# EasyEDA Pro project avaruusantenni_tallylight.eprj, board PCB1
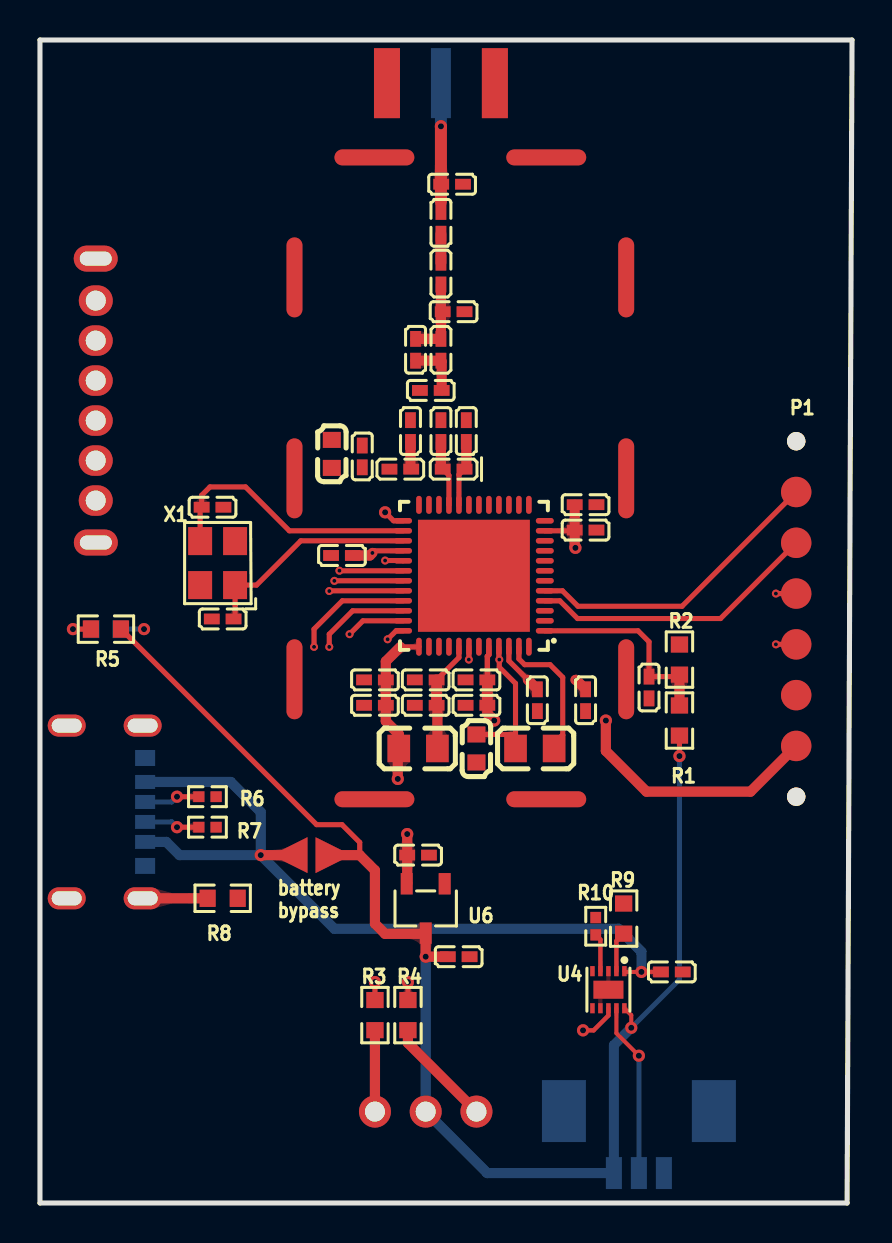
[diagram p8: board, top side]
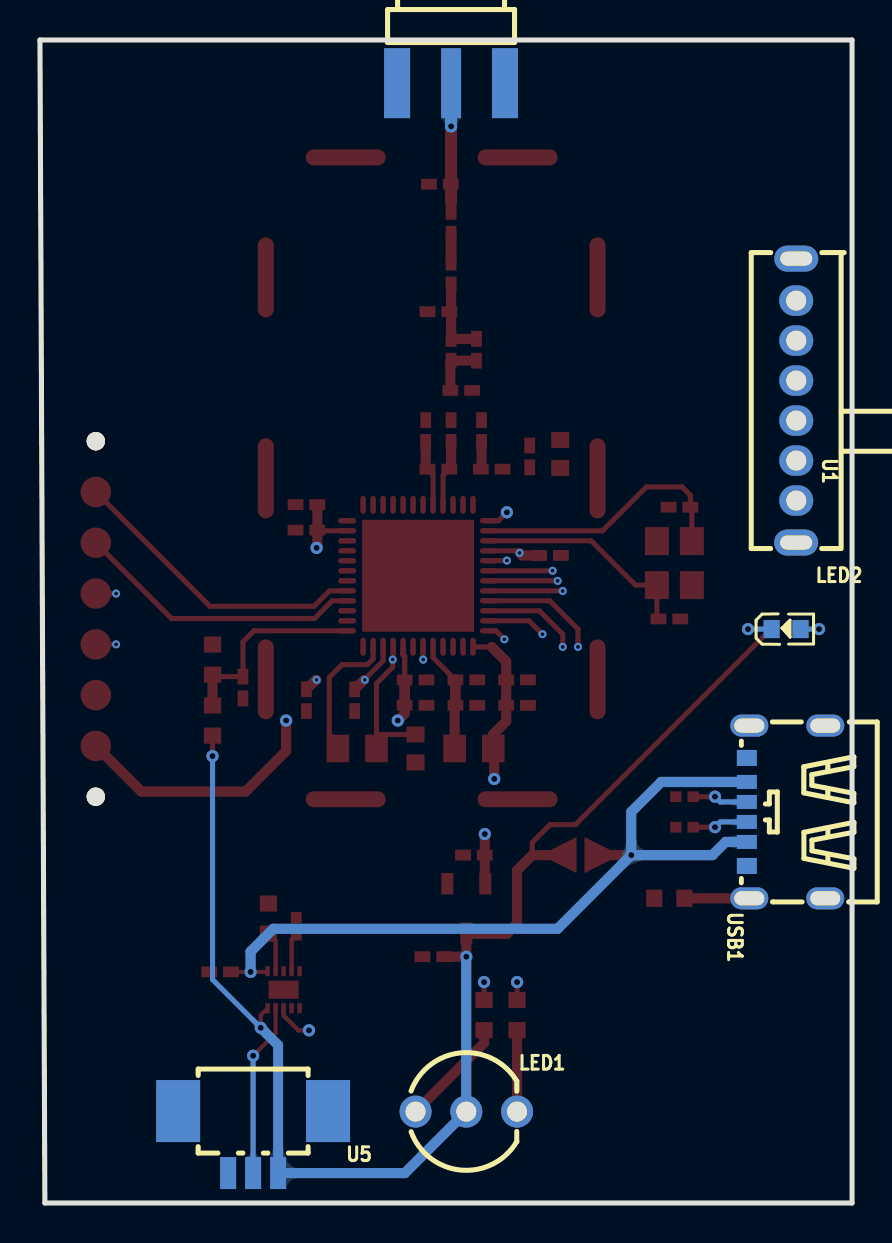
[diagram p9: board, bottom side, seen from below]

Outline 40.64 x 58.17 mm; copper layers: Top Layer, Inner1, Inner2, Bottom Layer. Coordinates in mm from the lower left corner of the outline.
Outline path: 0,58.17 40.64,58.17 40.39,0 0,0 0,58.17
Stack: Top Layer 0.035mm / Dielectric1 0.48mm PP er 4.5 / Inner1 0.035mm / Dielectric2 0.48mm FR4 er 4.5 / Inner2 0.035mm / Dielectric3 0.48mm PP er 4.5 / Bottom Layer 0.035mm

## Design rules (mm)
template: Custom Config
spacing copperThickness1oz (default): track to track 0.102, other pairs 0.152 to 0.3
spacing copperThickness2oz: track to track 0.203, other pairs 0.152 to 0.3
spacing copperThicknessInner0.5oz: track to track 0.089, other pairs 0.152 to 0.3
spacing Tight clearance: track to track 0.1, other pairs 0.1 to 0.3
track width copperThickness1oz (default): min 0.102, default 0.254, max 2.54
track width copperThickness2oz: min 0.203, default 0.254, max 2.54
track width copperThickness0.5oz: min 0.089, default 0.254, max 2.54
differential pair differentialPair (default): width min 0.127, default 0.254, max 2.54; gap min 0.152, default 0.152
via viaSize (default): diameter min 0.3, default 0.61, max 10; hole min 0.2, default 0.305, max 6.3
via viaSmall: diameter min 0.4, default 0.4, max 0.8; hole min 0.2, default 0.2, max 0.4
net RFI_P uses Trace pour
net RFI_N uses Trace pour
net RFO_HP uses Trace pour
net VR_PA uses Trace pour
net FB uses viaSmall
net SWDIO uses viaSmall
net PWR_LED uses viaSmall
net SWCLK uses viaSmall
net TALLYLED uses viaSmall
net AUXLED uses viaSmall
net SW_1 uses viaSmall
net SW_2 uses viaSmall
net SW_PWR uses viaSmall
net $3I6007/$1N692 uses Trace pour
net $3I6007/$1N693 uses Trace pour
net VDDPA uses viaSmall
['net', 'gnd'] ['NET', '$2N1736'] uses Trace pour

## Placement (name value [footprint] x y rotation side)
C1  10pF  [C0402]  9.14 29.21 0 top
C2  10pF  [C0402]  8.64 34.8 0 top
C3  47nF  [C0603]  14.6 37.47 270 top
C4  47pF  [C0402]  16.13 37.34 270 top
C5  2.2pF  [C0402]  18.8 42.67 90 top
C6  33pF  [C0402]  18.54 38.61 90 top
C7  33pF  [C0402]  20.07 49.02 90 top
C8  0.7pF  [C0402]  19.56 40.64 0 top
C9  7.5pF  [C0402]  20.7 44.58 180 top
C10  4.7pF  [C0402]  20.07 38.61 270 top
C11  2.2pF  [C0402]  20.62 50.95 180 top
C12  4.7pF  [C0402]  21.34 38.61 270 top
C14  470nF  [C0603]  21.84 22.73 90 top
C15  4.7uF  [C0402]  19.3 24.89 0 top
C16  100nF  [C0402]  19.3 26.16 0 top
C17  33pF  [C0402]  21.84 24.89 0 top
C18  100nF  [C0402]  21.84 26.16 0 top
C19  33pF  [C0402]  27.31 33.66 180 top
C20  100nF  [C0402]  27.31 34.92 180 top
C21  33pF  [C0402]  16.76 26.16 0 top
C22  100nF  [C0402]  16.76 24.89 0 top
C23  100nF  [C0402]  15.11 32.38 0 top
C24  4.7uF  [C0402]  27.31 25.15 90 top
C25  1uF  [C0402]  31.62 11.56 180 top
C26  1uF  [C0402]  20.96 12.32 180 top
C27  100nF  [C0402]  24.89 25.15 90 top
C28  1uF  [C0402]  18.92 17.4 180 top
C29  100nF  [C0402]  30.48 25.78 90 top
L1  47nH  [L0402]  18.03 36.7 180 top
L2  3.3nH  [L0402]  20.07 42.67 90 top
L3  8.2nH  [L0402]  20.07 46.48 90 top
L4  9.1nH  [L0402-RD]  20.7 36.7 180 top
L5  15uH  [L0805]  24.76 22.73 180 top
L6  Ferrite  [L0805]  18.92 22.73 0 top
LED1  TJ-L5FYTXHTCYLC2R6B-A5  [LED-TH_3P-BD5.9-P2.54-BI]  19.3 4.57 180 bottom
LED2  19-217/BHC-ZL1M2RY/3T  [LED0603-FD_BLUE]  3.3 28.7 180 bottom
P1  dbg-conn  [AA-DBG-1x6-2.54]  37.85 29.21 270 top
R1  470kΩ  [R0603]  32 24.13 270 top
R2  470kΩ  [R0603]  32 27.18 270 top
R3  220Ω  [R0603]  16.76 9.4 90 top
R4  220Ω  [R0603]  18.41 9.4 270 top
R5  220Ω  [R0603]  3.3 28.7 0 top
R6  5.1kΩ  [R0402]  8.38 20.32 0 top
R7  5.1kΩ  [R0402]  8.38 18.8 0 top
R8  470kΩ  [R0603]  9.14 15.24 180 top
R9  560Ω  [R0603]  29.21 14.22 270 top
R10  2.2kΩ  [R0402]  27.81 13.84 270 top
RF1  -  [RF-cage-32x16mm]  29.34 20.19 90 top
RF2  SMA-KE-P901  [SMA-TH_SMA-KE-P901]  20.07 56.01 180 bottom
U1  SK-14D01G3  [SW-TH_HOOYA_SK-14D01G3]  2.79 40.13 90 bottom
U2  -  [solderbridge_L]  13.59 17.4 0 top
U3  STM32WLE5CCU6  [UFQFPN-48_L7.0-W7.0-P0.50-BL-EP5.6]  21.72 31.37 90 top
U4  BQ24045DSQR  [WSON-10_L2.0-W2.0-P0.40-BL-EP]  28.45 10.67 180 top
U5  532610371  [CONN-TH_532610371]  29.97 3.05 0 bottom
U6  XC6206P332MR  [SOT-23-3_L2.9-W1.6-P1.90-LS2.8-BR]  19.3 14.73 90 top
USB1  TYPE-C 6P(073)  [TYPE-C-SMD_TYPE-C-6P]  3.3 19.56 90 bottom
X1  16MHz  [OSC-SMD_4P-L3.2-W2.5-BL]  8.89 32 90 top

## Footprints (pads in the part's own frame, mm; a bottom-side part is the same pattern mirrored in y, then rotated)
AA-DBG-1x6-2.54
  round 1.524 smd: 1(-6.35,0) 2(-3.81,0) 3(-1.27,0) 4(1.27,0) 5(3.81,0) 6(6.35,0)
  round 0.914 hole 0.914: 7(-8.89,0) 7(8.89,0)
C0402
  rect 0.79x0.54 smd: 1(-0.545,0) 2(0.545,0)
C0603
  rect 0.8x0.9 smd: 1(-0.7,0) 2(0.7,0)
CONN-TH_532610371
  rect 0.8x1.6 smd: 1(-1.25,1.55) 2(0,1.55) 3(1.25,1.55)
  rect 2.2x3.1 smd: 4(3.75,-1.55) 5(-3.75,-1.55)
L0402
  rect 0.79x0.54 smd: 1(-0.545,0) 2(0.545,0)
L0402-RD
  rect 0.79x0.54 smd: 1(-0.545,0) 2(0.545,0)
L0805
  rect 1.133x1.377 smd: 1(-0.966,0) 2(0.966,0)
LED0603-FD_BLUE
  rect 0.8x0.9 smd: 1(-0.72,0) 2(0.72,0)
LED-TH_3P-BD5.9-P2.54-BI
  round 1.6 hole 1: 1(-2.54,0) 2(0,0) 3(2.54,0)
OSC-SMD_4P-L3.2-W2.5-BL
  rect 1.4x1.2 smd: 1(-1.1,-0.875) 2(1.1,-0.875) 3(1.1,0.875) 4(-1.1,0.875)
R0402
  rect 0.566x0.54 smd: 1(-0.433,0) 2(0.433,0)
R0603
  rect 0.806x0.864 smd: 1(-0.753,0) 2(0.753,0)
RF-cage-32x16mm
  oval 0.8x4 smd: 1(0,12.6) 1(0,4) 1(32.1,12.6) 1(32.1,4)
  oval 4x0.8 smd: 1(6,16.6) 1(6,0) 1(16.05,16.6) 1(16.05,0) 1(26.1,16.6) 1(26.1,0)
SMA-TH_SMA-KE-P901
  rect 1.3x3.5 smd: 1(-2.7,0) 2(2.7,0)
  rect 1.3x3.5 smd far side: 3(-2.7,0) 4(2.7,0)
  rect 1x3.5 smd: 5(0,0)
solderbridge_L
  custom 1.8x1.8 smd: 1(-1.1,0) 2(1.1,0)
SOT-23-3_L2.9-W1.6-P1.90-LS2.8-BR
  rect 1.07x0.6 smd: 1(1.235,-0.95) 2(1.235,0.95) 3(-1.235,0)
SW-TH_HOOYA_SK-14D01G3
  oval 1.524x1.7 hole 1: 1(-5,-0.003) 2(-3,-0.003) 3(-1,-0.003) 4(1,-0.003) 5(3,-0.003) 6(5,0)
  oval 1.3x2.2 hole 0.7x1.6: 7(-7.1,0.003) 8(7.1,-0.003)
TYPE-C-SMD_TYPE-C-6P
  oval 1.1x1.9 hole 0.7x1.5: 7(-4.32,-1.962) 7(-4.32,1.837) 7(4.32,-1.962) 7(4.32,1.837)
  rect 0.7x1 smd: A5(-0.5,1.962) A9(1.5,1.962) B5(0.5,1.962) B9(-1.5,1.962)
  rect 0.8x1 smd: A12(2.7,1.962) B12(-2.7,1.962)
UFQFPN-48_L7.0-W7.0-P0.50-BL-EP5.6
  oval 0.28x0.9 smd: 1(-2.751,-3.547) 2(-2.251,-3.547) 3(-1.75,-3.547) 4(-1.25,-3.547) 5(-0.75,-3.547) 6(-0.249,-3.547) 7(0.249,-3.547) 8(0.75,-3.547) 9(1.25,-3.547) 10(1.75,-3.547) 11(2.251,-3.547) 12(2.751,-3.547) 25(2.751,3.547) 26(2.251,3.547) 27(1.75,3.547) 28(1.25,3.547) 29(0.75,3.547) 30(0.249,3.547) 31(-0.249,3.547) 32(-0.75,3.547) 33(-1.25,3.547) 34(-1.75,3.547) 35(-2.251,3.547) 36(-2.751,3.547)
  oval 0.9x0.28 smd: 13(3.547,-2.75) 14(3.547,-2.25) 15(3.547,-1.75) 16(3.547,-1.25) 17(3.547,-0.75) 18(3.547,-0.25) 19(3.547,0.25) 20(3.547,0.75) 21(3.547,1.25) 22(3.547,1.75) 23(3.547,2.25) 24(3.547,2.75) 37(-3.547,2.751) 38(-3.547,2.251) 39(-3.547,1.75) 40(-3.547,1.25) 41(-3.547,0.75) 42(-3.547,0.249) 43(-3.547,-0.249) 44(-3.547,-0.75) 45(-3.547,-1.25) 46(-3.547,-1.75) 47(-3.547,-2.251) 48(-3.547,-2.751)
  rect 5.6x5.6 smd: 49(0,0)
WSON-10_L2.0-W2.0-P0.40-BL-EP
  rect 0.224x0.505 smd: 1(-0.8,-0.927) 2(-0.4,-0.927) 3(0,-0.927) 4(0.4,-0.927) 5(0.8,-0.927) 6(0.8,0.927) 7(0.4,0.927) 8(0,0.927) 9(-0.4,0.927) 10(-0.8,0.927)
  rect 1.5x0.9 smd: 11(0,0)

## Nets
3V3: C17.2 C18.2 C19.2 C20.2 C21.2 C22.2 C28.2 L6.1 P1.6 U3.11 U3.37 U3.44 U6.2
5V: C25.2 U2.1 U4.1 USB1.A9 USB1.B9
GND: C1.1 C2.2 C3.1 C4.1 C8.1 C9.1 C11.1 C12.1 C14.1 C15.1 C16.1 C17.1 C18.1 C19.1 C20.1 C21.1 C22.1 C23.1 C24.1 C25.1 C26.1 C27.1 C28.1 C29.1 P1.5 R2.1 R6.2 R7.2 R8.1 R9.1 R10.1 RF1.1 RF2.1 RF2.2 RF2.3 RF2.4 U1.1 U1.2 U1.6 U3.48 U3.49 U4.3 U4.7 U4.11 U5.3 U6.1 USB1.A12 USB1.B12 X1.2 X1.4
VDDA: C15.2 C16.2 L6.2 U3.41
VDDPA: C23.2 C24.2 C27.2 U3.25 U3.28 U3.46
AUXLED: R4.1 U3.34
BATTERY_MEAS: C29.2 R1.1 R2.2 U3.1
FB: C14.2 L5.2 U3.29 U3.45
MCU_RX: P1.1 U3.5
MCU_TX: P1.2 U3.4
NTC: U4.9 U5.2
OSC_IN: C2.1 U3.26 X1.3
OSC_OUT: C1.2 U3.27 X1.1
PWR_LED: LED2.1 U3.35 U4.8
RFI_N: C10.2 L4.2 U3.21
RFI_P: C12.2 L4.1 U3.20
RFO_HP: C6.1 L1.1 U3.23
SMPS: L5.1 U3.47
SW_1: U1.4 U3.31
SW_2: U1.5 U3.30
SW_PWR: U1.3 U3.32
SWCLK: P1.3 U3.42
SWDIO: P1.4 U3.36
TALLYLED: R3.2 U3.33
V_BAT: C26.2 LED1.2 R1.2 R5.2 U2.2 U4.10 U5.1 U6.3
VR_PA: C3.2 C4.2 L1.2 U3.24
$1N8346: LED2.2 R5.1
$1N9891: LED1.3 R3.1
$1N9911: LED1.1 R4.2
$2N347: R7.1 USB1.A5
$2N453: R6.1 USB1.B5
$2N553: R8.2 USB1.7
$2N1572: R9.2 U4.2
$2N1736: R10.2 U4.4
$3I6007/$1N692: C5.1 C6.2 C8.2 C10.1 L2.1
$3I6007/$1N693: C5.2 C9.2 L2.2 L3.1
$3I6007/$1N694: C7.1 L3.2
$3N6560: C7.2 C11.2 RF2.5

Pads without a net: P1 7; U1 7 8; U3 2 3 6 7 8 9 10 12 13 14 15 16 17 18 19 22 38 39 40 43; U4 5 6; U5 4 5

## Via types
v1: diameter 0.61, hole 0.305, Top Layer to Bottom Layer, 20 vias
v2: diameter 0.4, hole 0.2, Top Layer to Bottom Layer, 15 vias

## Routing (per net, layer and track width the routed paths; a pad name or vN(x,y) marks a point on that pad's centre or on a via; arc(x,y) is an arc through that point)
3V3: length 56.3
  Top Layer w0.254: U3.37 18.96,27.81 18.03,27.81 ; U3.11 26.72,33.62 C19.2
  Top Layer w0.27: U3.44 22.47,27.42 22.39,27.34 C18.2
  Top Layer w0.5: C20.2 C19.2
  Top Layer w0.508: v1(28.32,24.13) 28.32,22.61 30.35,20.57 35.56,20.57 P1.6 ; v1(22.73,24.13) 22.39,24.47 C17.2 ; C19.2 26.76,32.8 v1(26.8,32.77) ; U6.2 18.38,15.99 C28.2 v1(18.38,18.45) ; v1(17.91,21.21) 17.91,22.68 L6.1 17.96,23.44 17.31,24.09 C22.2 C21.2 17.31,27.09 18.03,27.81
  Top Layer w0.54: C18.2 C17.2
  Inner2 w0.508: v1(17.91,21.21) 17.91,18.92 v1(18.38,18.45) 22.73,22.81 v1(22.73,24.13) v1(28.32,24.13) 28.32,31.24 v1(26.8,32.77)
5V: length 40
  Top Layer w0.2: U4.1 29.29,11.56 v1(30.1,11.56) C25.2
  Top Layer w0.508: v1(11.05,17.4) U2.1
  Bottom Layer w0.508: v1(30.1,11.56) 30.1,12.57 28.96,13.72 14.73,13.72 v1(11.05,17.4) ; USB1.A9 9.55,21.06 11.05,19.56 v1(11.05,17.4) ; v1(11.05,17.4) 6.99,17.4 6.33,18.06 USB1.B9
VDDA: length 5.3
  Top Layer w0.254: U3.41 20.97,27.28 C16.2
  Top Layer w0.508: C15.2 19.89,24.85 19.89,22.99
  Top Layer w0.54: C15.2 C16.2
VDDPA: length 25.2
  Top Layer w0.254: v1(17.27,34.54) 17.7,34.12 U3.25 ; v2(16.64,32.51) 16.74,32.62 U3.28 ; v2(24.38,26.16) 24.42,26.16 23.47,27.12 U3.46
  Top Layer w0.508: 24.42,26.16 C27.2 ; v2(16.64,32.51) 16.51,32.38 C23.2 ; v2(26.8,26.16) 26.83,26.16 C24.2
  Inner2 w0.508: v1(17.27,34.54) 16.64,33.91 v2(16.64,32.51) 16.64,27.94 18.8,25.78 24,25.78 v2(24.38,26.16) v2(26.8,26.16)
AUXLED: length 24.1
  Top Layer w0.254: R4.1 v1(18.41,11.05) ; U3.34 15.65,29.62 14.48,28.45 v2(14.48,27.81)
  Inner1 w0.254: v1(18.41,11.05) 18.41,16.51 14.48,20.45 v2(14.48,27.81)
BATTERY_MEAS: length 10.3
  Top Layer w0.254: U3.1 29.93,28.62 30.48,28.07 30.48,26.36 30.44,26.33 ; C29.2 31.91,26.33 R2.2
  Top Layer w0.508: R1.1 R2.2
FB: length 17.7
  Top Layer w0.254: U3.45 22.97,27.2 v2(22.99,27.18) 22.99,26.8 23.8,25.98 23.8,23.32 23.68,23.43 C14.2 ; U3.29 18.16,32.13 v2(17.27,32.13)
  Inner2 w0.4: v2(22.99,27.18) 22.35,27.18 21.72,26.54 20.07,26.54 17.27,29.34 v2(17.27,32.13)
MCU_RX: length 15.3
  Top Layer w0.254: U3.5 26.15,30.62 26.92,29.84 32.13,29.84 P1.1
MCU_TX: length 14.5
  Top Layer w0.254: U3.4 26.01,30.12 26.9,29.23 34.06,29.23 P1.2
NTC: length 8.7
  Top Layer w0.2: v1(29.97,7.37) 28.85,8.49 U4.9
  Bottom Layer w0.254: v1(29.97,7.37) U5.2
OSC_IN: length 13.5
  Top Layer w0.254: U3.26 12.48,33.62 10.29,35.81 8.51,35.81 8.09,35.4 C2.1 8.01,34.72 X1.3
OSC_OUT: length 11
  Top Layer w0.254: U3.27 13.05,33.12 10.84,30.9 X1.1 9.76,29.29 C1.2
PWR_LED: length 41.1
  Top Layer w0.22: v1(27.18,8.64) 27.71,8.64 28.45,9.38 U4.8
  Top Layer w0.254: v2(15.49,28.45) 16.16,29.12 U3.35
  Inner1 w0.22: v2(15.49,28.45) 15.49,22.61 23.62,14.48 23.62,12.19 v1(27.18,8.64)
  Inner1 w0.254: v1(5.21,28.7) 15.24,28.7 v2(15.49,28.45)
  Bottom Layer w0.254: v1(5.21,28.7) 4.06,28.7
RFI_N: length 3.3
  Top Layer w0.254: U3.21 20.47,36.39 L4.2
  Top Layer w0.508: L4.2 20.07,36.79 C10.2
RFI_P: length 3.3
  Top Layer w0.254: U3.20 20.97,36.42 L4.1
  Top Layer w0.508: L4.1 21.34,36.79 C12.2
RFO_HP: length 1.4
  Top Layer w0.508: C6.1 18.54,36.74 18.58,36.7
SMPS: length 6.7
  Top Layer w0.254: U3.47 23.97,27.21 24.26,26.92 25.53,26.92 26.16,26.29 26.16,23.42 25.73,22.99
SW_1: length 20.6
  Top Layer w0.254: v2(14.73,31.11) 14.74,31.12 U3.31
  Inner2 w0.254: v2(14.73,31.11) 12.83,33.02 12.83,34.8 6.49,41.13 U1.4
SW_2: length 21.4
  Top Layer w0.254: U3.30 14.99,31.62 v2(14.99,31.62)
  Inner2 w0.254: v2(14.99,31.62) 13.46,33.15 13.46,35.31 5.64,43.13 U1.5
SW_PWR: length 19.7
  Top Layer w0.254: U3.32 14.49,30.62 v2(14.48,30.61)
  Inner2 w0.254: v2(14.48,30.61) 12.19,32.89 12.19,34.29 7.35,39.13 U1.3
SWCLK: length 18.4
  Top Layer w0.254: v2(36.83,30.48) P1.3 ; v2(21.46,27.18) 21.47,27.18 U3.42
  Inner1 w0.254: v2(36.83,30.48) 34.16,27.81 22.1,27.81 v2(21.46,27.18)
SWDIO: length 23
  Top Layer w0.254: v2(17.4,28.19) 17.82,28.62 U3.36 ; v2(36.83,27.94) P1.4
  Inner1 w0.254: v2(36.83,27.94) 35.81,26.92 24.13,26.92 23.37,26.16 19.43,26.16 v2(17.4,28.19)
TALLYLED: length 24.9
  Top Layer w0.254: U3.33 15.13,30.12 13.72,28.7 v2(13.72,27.81) ; v1(16.76,11.05) R3.2
  Inner1 w0.254: v1(16.76,11.05) 16.76,16.13 13.72,19.18 v2(13.72,27.81)
V_BAT: length 69.9
  Top Layer w0.2: U4.10 29.59,9.4 v1(29.59,8.76)
  Top Layer w0.254: 16,17.4 16,18.03 15.11,18.92 13.84,18.92 4.06,28.7 R5.2 ; v1(32,22.35) R1.2
  Top Layer w0.508: U2.2 16,17.4 16.76,16.64 16.76,13.97 17.27,13.46 19.27,13.46 U6.3 v1(19.3,12.32) C26.2
  Bottom Layer w0.254: v1(32,22.35) 32,11.18 v1(29.59,8.76)
  Bottom Layer w0.5: U5.1 28.72,7.89 v1(29.59,8.76)
  Bottom Layer w0.508: v1(19.3,12.32) LED1.2 22.38,1.5 U5.1
$1N8346: length 1.8
  Top Layer w0.254: v1(1.65,28.7) R5.1
  Bottom Layer w0.254: v1(1.65,28.7) LED2.2
$1N9891: length 4.1
  Top Layer w0.508: R3.1 LED1.3
$1N9911: length 5.5
  Top Layer w0.508: R4.2 18.41,8 LED1.1
$2N347: length 2.8
  Top Layer w0.254: v1(6.86,18.8) R7.1
  Bottom Layer w0.254: v1(6.86,18.8) 6.6,19.06 USB1.A5
$2N453: length 2.8
  Top Layer w0.254: v1(6.86,20.32) R6.1
  Bottom Layer w0.254: v1(6.86,20.32) 6.6,20.06 USB1.B5
$2N553: length 19.5
  Top Layer w0.508: R8.2 5.14,15.24 USB1.7
  Inner1 w0.254: USB1.7 USB1.7 USB1.7 USB1.7
$2N1572: length 2
  Top Layer w0.22: U4.2 28.85,13.11 R9.2
$2N1736: length 1.9
  Top Layer w0.22: U4.4 28.05,13.17 R10.2
$3I6007/$1N692: length 2.8
  Top Layer w0.5: 20.1,40.64 20.1,42.09 L2.1 C5.1
$3I6007/$1N693: length 4.1
  Top Layer w0.508: L3.1 20.07,44.67 C9.2 20.07,44.49 L2.2 C5.2
$3I6007/$1N694: length 1.5
  Top Layer w0.54: L3.2 C7.1
$3N6560: length 5.6
  Top Layer w0.5: C7.2 20.07,50.08 ; 20.07,50.94 C11.2
  Top Layer w0.6: 20.07,50.97 20.07,50.08 ; 20.07,50.97 v1(20.07,53.85) ; 20.07,50.97 C11.2
  Bottom Layer w0.6: v1(20.07,53.85) 20.07,55.1

## Copper pours and planes (outline as drawn; the poured copper is in the pictures)
GND on Top Layer: -1.02,59.18 41.15,59.18 41.15,-0.76 -1.02,-0.76
GND on Bottom Layer: -4.06,62.23 44.2,62.23 44.2,-3.81 -4.06,-3.81
GND on Inner1: -2.03,60.2 42.16,60.2 42.16,-1.78 -2.03,-1.78
GND on Inner2: -3.05,61.21 43.18,61.21 43.18,-2.79 -3.05,-2.79
RFO_HP on Top Layer: 19.61,35.15 19.35,35.15 19.15,35.56 18.24,36.42 18.14,36.42 18.14,36.98 19,36.98 19,36.42 19.61,35.81
VR_PA on Top Layer: 14.1,37.21 17.91,37.21 17.91,36.32 18.8,35.43 18.95,35.36 18.97,34.47 18.75,34.47 16.89,36.32 14.1,36.32
$3I6007/$1N692 on Top Layer: 18.24,38.76 20.37,38.76 20.52,40.23 20.52,40.54 19.71,40.54 19.66,39.93 19.35,39.62 18.24,39.57

Small or netless copper shapes (teardrops, artwork), in the pictures only: 127 on Top Layer, 17 on Bottom Layer, 7 on Inner1, 16 on Inner2

## Text on the board
Top Silkscreen Layer: battery / bypass
